# Altium schematic sheet MCU.SchDoc
size A; SPICEModelCacheZTCALRQY: <root> / <DocumentId>ZTCALRQY</DocumentId> / <CacheFrame Number="0"> / <Model Name="cap" Kind="MDL"> / <Text>*Default semiconductor capacitor / .MODEL CAP C()</Text> / </Model> / </CacheFrame> / </root>
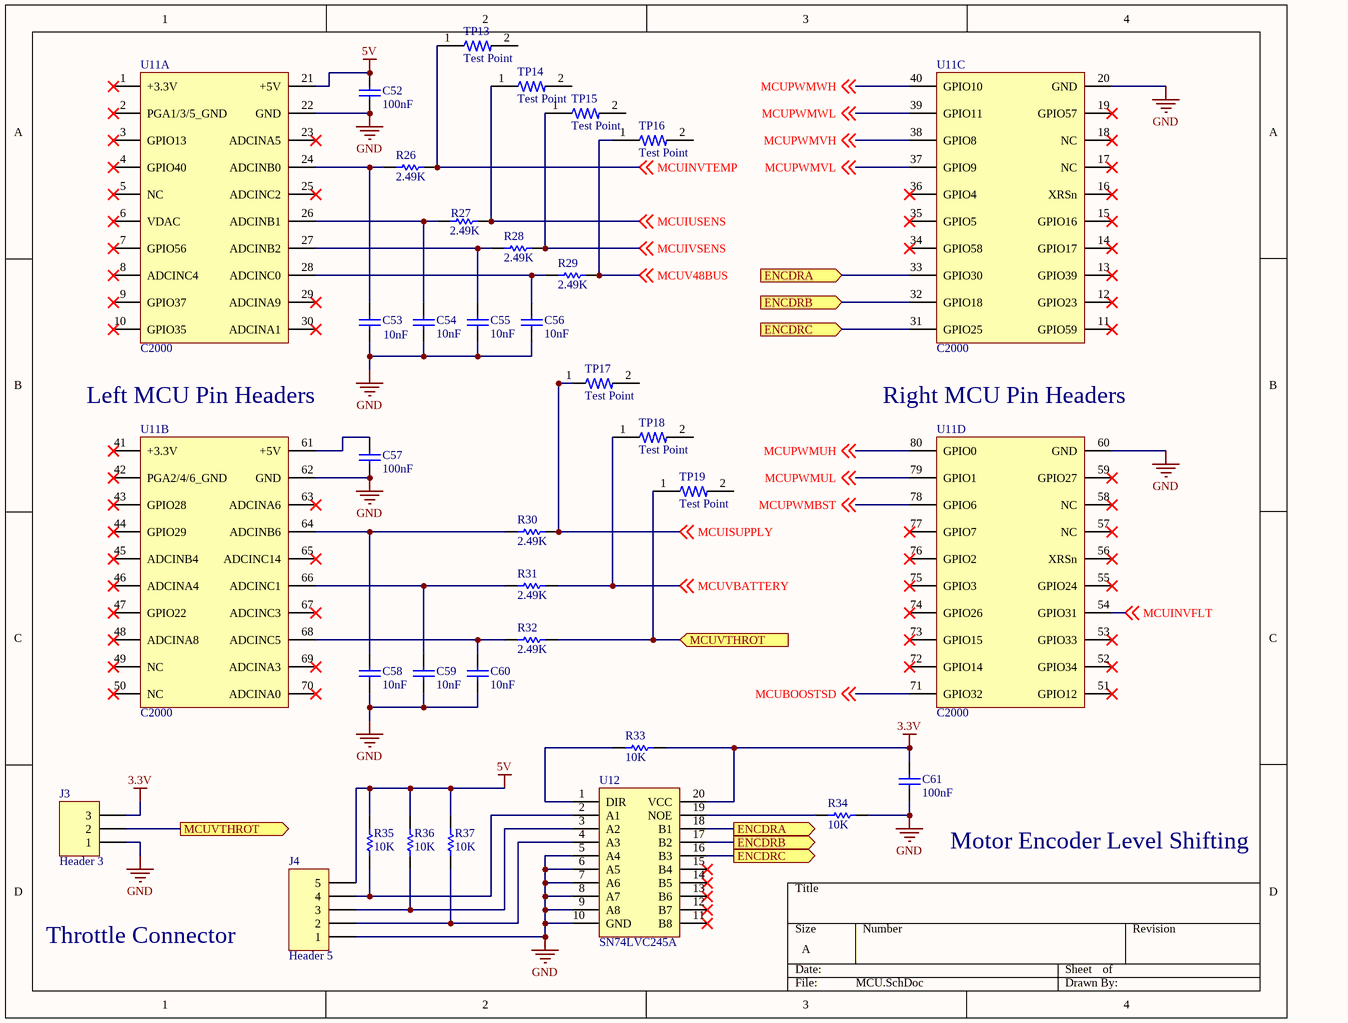
[diagram p0: MCU.SchDoc]

## Parts
C52  100nF  [CAPC1609X100X15LL20]
C53  10nF  [CAPC1609X100X15LL20]
C54  10nF  [CAPC1609X100X15LL20]
C55  10nF  [CAPC1609X100X15LL20]
C56  10nF  [CAPC1609X100X15LL20]
C57  100nF  [CAPC1609X100X15LL20]
C58  10nF  [CAPC1609X100X15LL20]
C59  10nF  [CAPC1609X100X15LL20]
C60  10nF  [CAPC1609X100X15LL20]
C61  100nF  [CAPC1609X100X15LL20]
J3  Header 3  [3-Pin TB 5mm Pitch]
J4  Header 5  [5-Pin TB 5mm Pitch]
R26  2.49K  [RESC1609X50X30NL8T20]
R27  2.49K  [RESC1609X50X30NL8T20]
R28  2.49K  [RESC1609X50X30NL8T20]
R29  2.49K  [RESC1609X50X30NL8T20]
R30  2.49K  [RESC1609X50X30NL8T20]
R31  2.49K  [RESC1609X50X30NL8T20]
R32  2.49K  [RESC1609X50X30NL8T20]
R33  10K  [RESC1609X50X30NL8T20]
R34  10K  [RESC1609X50X30NL8T20]
R35  10K  [RESC1609X50X30NL8T20]
R36  10K  [RESC1609X50X30NL8T20]
R37  10K  [RESC1609X50X30NL8T20]
TP13  Test Point  [RESC3216X70N]
TP14  Test Point  [RESC3216X70N]
TP15  Test Point  [RESC3216X70N]
TP16  Test Point  [RESC3216X70N]
TP17  Test Point  [RESC3216X70N]
TP18  Test Point  [RESC3216X70N]
TP19  Test Point  [RESC3216X70N]
U11  C2000  [C2000]  (parts A,B,C,D of 4)
U12  SN74LVC245A  [20TSSOP]

## Ports
ENCDRA (in), ENCDRA (out), ENCDRB (in), ENCDRB (out), ENCDRC (in), ENCDRC (out), MCUVTHROT (in), MCUVTHROT (out)

## Nets
3.3V: C61.2 J3.3 R33.2 U12.20(VCC)
5V: C52.2 J4.5 R35.2 R36.2 R37.2 U11.21(+5V)
GND: C52.1 C53.1 C54.1 C55.1 C56.1 C57.1 C58.1 C59.1 C60.1 C61.1 J3.1 J4.1 R34.2 U11.20(GND) U11.22(GND) U11.60(GND) U11.62(GND) U12.5(A4) U12.6(A5) U12.7(A6) U12.8(A7) U12.9(A8) U12.10(GND)
ENCDRA: U11.33(GPIO30) U12.18(B1) ; port ENCDRA
ENCDRB: U11.32(GPIO18) U12.17(B2) ; port ENCDRB
ENCDRC: U11.31(GPIO25) U12.16(B3) ; port ENCDRC
MCUBOOSTSD: U11.71(GPIO32) ; off-sheet MCUBOOSTSD
MCUINVFLT: U11.54(GPIO31) ; off-sheet MCUINVFLT
MCUINVTEMP: R26.2 TP13.1 ; off-sheet MCUINVTEMP
MCUISUPPLY: R30.2 TP17.1 ; off-sheet MCUISUPPLY
MCUIUSENS: R27.2 TP14.1 ; off-sheet MCUIUSENS
MCUIVSENS: R28.2 TP15.1 ; off-sheet MCUIVSENS
MCUPWMBST: U11.78(GPIO6) ; off-sheet MCUPWMBST
MCUPWMUH: U11.80(GPIO0) ; off-sheet MCUPWMUH
MCUPWMUL: U11.79(GPIO1) ; off-sheet MCUPWMUL
MCUPWMVH: U11.38(GPIO8) ; off-sheet MCUPWMVH
MCUPWMVL: U11.37(GPIO9) ; off-sheet MCUPWMVL
MCUPWMWH: U11.40(GPIO10) ; off-sheet MCUPWMWH
MCUPWMWL: U11.39(GPIO11) ; off-sheet MCUPWMWL
MCUV48BUS: R29.2 TP16.1 ; off-sheet MCUV48BUS
MCUVBATTERY: R31.2 TP18.1 ; off-sheet MCUVBATTERY
MCUVTHROT: J3.2 R32.2 TP19.1 ; port MCUVTHROT
NetC53_2: C53.2 R26.1 U11.24(ADCINB0)
NetC54_2: C54.2 R27.1 U11.26(ADCINB1)
NetC55_2: C55.2 R28.1 U11.27(ADCINB2)
NetC56_2: C56.2 R29.1 U11.28(ADCINC0)
NetC57_2: C57.2 U11.61(+5V)
NetC58_2: C58.2 R30.1 U11.64(ADCINB6)
NetC59_2: C59.2 R31.1 U11.66(ADCINC1)
NetC60_2: C60.2 R32.1 U11.68(ADCINC5)
NetJ4_2: J4.2 R37.1 U12.4(A3)
NetJ4_3: J4.3 R36.1 U12.3(A2)
NetJ4_4: J4.4 R35.1 U12.2(A1)
NetR33_1: R33.1 U12.1(DIR)
NetR34_1: R34.1 U12.19(NOE)

Not connected (* = marked no-connect by the designer): TP13 2; TP14 2; TP15 2; TP16 2; TP17 2; TP18 2; TP19 2; U11 1(+3.3V)* 2(PGA1/3/5_GND)* 3(GPIO13)* 4(GPIO40)* 5(NC)* 6(VDAC)* 7(GPIO56)* 8(ADCINC4)* 9(GPIO37)* 10(GPIO35)* 11(GPIO59)* 12(GPIO23)* 13(GPIO39)* 14(GPIO17)* 15(GPIO16)* 16(XRSn)* 17(NC)* 18(NC)* 19(GPIO57)* 23(ADCINA5)* 25(ADCINC2)* 29(ADCINA9)* 30(ADCINA1)* 34(GPIO58)* 35(GPIO5)* 36(GPIO4)* 41(+3.3V)* 42(PGA2/4/6_GND)* 43(GPIO28)* 44(GPIO29)* 45(ADCINB4)* 46(ADCINA4)* 47(GPIO22)* 48(ADCINA8)* 49(NC)* 50(NC)* 51(GPIO12)* 52(GPIO34)* 53(GPIO33)* 55(GPIO24)* 56(XRSn)* 57(NC)* 58(NC)* 59(GPIO27)* 63(ADCINA6)* 65(ADCINC14)* 67(ADCINC3)* 69(ADCINA3)* 70(ADCINA0)* 72(GPIO14)* 73(GPIO15)* 74(GPIO26)* 75(GPIO3)* 76(GPIO2)* 77(GPIO7)*; U12 11(B8)* 12(B7)* 13(B6)* 14(B5)* 15(B4)*

## Notes on the sheet
- (near U11) Left MCU Pin Headers
- (near U11) Right MCU Pin Headers
- Motor Encoder Level Shifting
- Throttle Connector

## Library data of the parts
C52-C61 = CMP-2006-00186-1: Manufacturer: AVX Interconnect / Elco; Part Number: TACL105M006XTA
J3 = Header 3: Header, 3-Pin; LatestRevisionDate: 17-Jul-2002; LatestRevisionNote: Re-released for DXP Platform.; Publisher: Altium Limited
J4 = Header 5: Header, 5-Pin; LatestRevisionDate: 17-Jul-2002; LatestRevisionNote: Re-released for DXP Platform.; Publisher: Altium Limited
R26-R37 = CMP-2000-03816-5: Chip Resistor, 0 Ohm, Jumper, 100 mW, -55 to 155 degC, 0603 (1608 Metric), RoHS, Tape and Reel; Manufacturer: Vishay Semiconductor; Voltage Rating: 75 V; Package Quantity: 5000; DatasheetVersion: 06/2012; Min Operating Temperature: -55 degC; ComponentLink1URL: http://www.vishay.com/; Mounting Technology: Surface Mount; Height: 0.45 mm; ComponentLink1Description: Manufacturer URL; REACH SVHC: Unknown; PackageReference: 0603; Packaging: Tape and Reel; Max Operating Temperature: 155 degC; Mount: Surface Mount; ComponentLink2Description: Datasheet; PackageDescription: 2-Pin Surface Mount Device, Body 1.575 x 0.85 mm; Length: 1.55 mm; ComponentLink2URL: http://www.vishay.com/docs/20035/dcrcwe3.pdf; Pins: 2; RoHSCompliant: true
TP13-TP19 = RCWCTE: PC Test Point , Plating Surface Mount Mounting Type; MF: KOA Speer; Package: 1206 KOA Speer; Value: *; Price: None; Availability: Unavailable; MP: RCWCTE; SnapEDA_Link: https://www.snapeda.com/parts/RCWCTE/KOA%20Speer/view-part/1310479/?ref=snap
U11 = C2000: F280049C; Parameter 1: test 2
U12 = SN74LVC245A: Logic Level Transciever